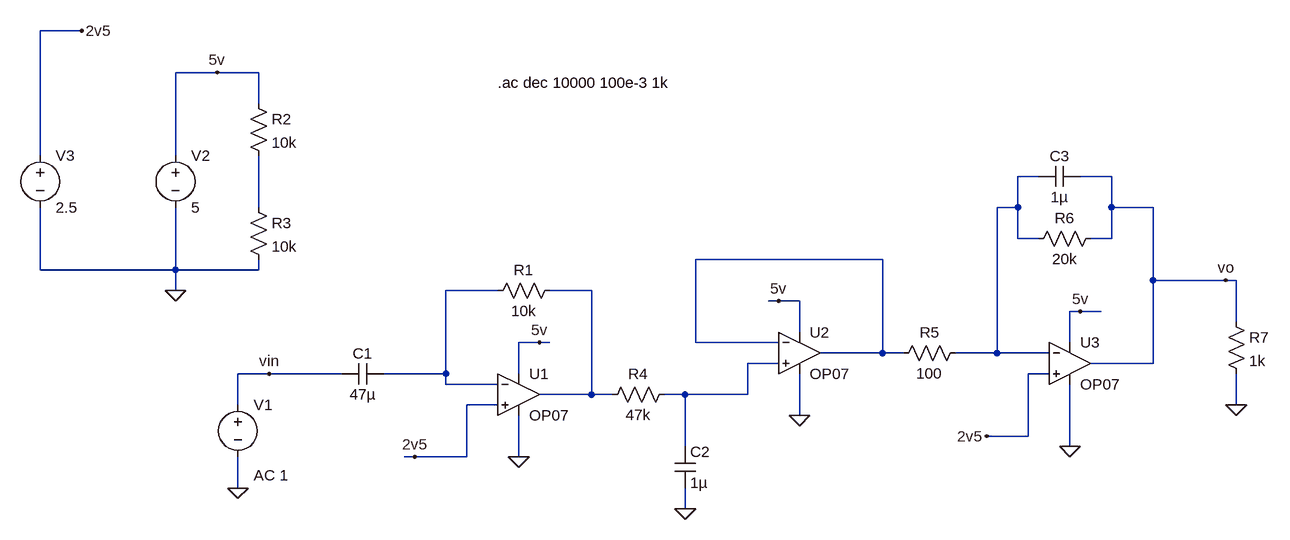
[diagram p0: schematic OpAmp3_AnDev.asc]
OpAmp3_AnDev.asc, the LTspice schematic file:
Version 4
SHEET 1 1240 680
WIRE -592 -400 -656 -400
WIRE -384 -336 -448 -336
WIRE -320 -336 -384 -336
WIRE -320 -288 -320 -336
WIRE -656 -208 -656 -400
WIRE -448 -208 -448 -336
WIRE 880 -176 848 -176
WIRE 992 -176 944 -176
WIRE -320 -128 -320 -208
WIRE 848 -128 848 -176
WIRE 848 -128 816 -128
WIRE 992 -128 992 -176
WIRE 1056 -128 992 -128
WIRE 848 -80 848 -128
WIRE 880 -80 848 -80
WIRE 992 -80 992 -128
WIRE 992 -80 960 -80
WIRE 640 -48 352 -48
WIRE -656 -32 -656 -128
WIRE -448 -32 -448 -128
WIRE -448 -32 -656 -32
WIRE -320 -32 -320 -48
WIRE -320 -32 -448 -32
WIRE 1056 -16 1056 -128
WIRE 1168 -16 1056 -16
WIRE 1184 -16 1168 -16
WIRE -448 0 -448 -32
WIRE 48 0 -32 0
WIRE 192 0 128 0
WIRE 480 16 464 16
WIRE 512 16 480 16
WIRE 944 32 928 32
WIRE 976 32 944 32
WIRE 1184 48 1184 -16
WIRE 512 64 512 16
WIRE 112 80 80 80
WIRE 128 80 112 80
WIRE 352 80 352 -48
WIRE 480 80 352 80
WIRE 928 80 928 32
WIRE 640 96 640 -48
WIRE 640 96 544 96
WIRE 672 96 640 96
WIRE 816 96 816 -128
WIRE 816 96 752 96
WIRE 896 96 816 96
WIRE 480 112 432 112
WIRE 1056 112 1056 -16
WIRE 1056 112 960 112
WIRE -304 128 -352 128
WIRE -192 128 -304 128
WIRE -32 128 -32 0
WIRE -32 128 -128 128
WIRE 80 128 80 80
WIRE 896 128 864 128
WIRE -32 144 -32 128
WIRE 48 144 -32 144
WIRE 192 160 192 0
WIRE 192 160 112 160
WIRE 224 160 192 160
WIRE 336 160 304 160
WIRE 432 160 432 112
WIRE 432 160 336 160
WIRE -352 176 -352 128
WIRE 48 176 0 176
WIRE 1184 176 1184 128
WIRE 512 192 512 128
WIRE 864 224 864 128
WIRE 864 224 800 224
WIRE 336 240 336 160
WIRE 928 240 928 144
WIRE -80 256 -96 256
WIRE 0 256 0 176
WIRE 0 256 -80 256
WIRE 80 256 80 192
WIRE -352 304 -352 256
WIRE 336 336 336 304
FLAG -352 304 0
FLAG -448 0 0
FLAG -384 -336 5v
FLAG 80 256 0
FLAG 112 80 5v
FLAG -80 256 2v5
FLAG 336 336 0
FLAG 512 192 0
FLAG 480 16 5v
FLAG 800 224 2v5
FLAG 928 240 0
FLAG 944 32 5v
FLAG 1184 176 0
FLAG -592 -400 2v5
FLAG 1168 -16 vo
FLAG -304 128 vin
SYMBOL OpAmps\\OP07 80 96 R0
SYMATTR InstName U1
SYMBOL OpAmps\\OP07 512 32 R0
SYMATTR InstName U2
SYMBOL OpAmps\\OP07 928 48 R0
SYMATTR InstName U3
SYMBOL cap -128 112 R90
WINDOW 0 0 32 VBottom 2
WINDOW 3 32 32 VTop 2
SYMATTR InstName C1
SYMATTR Value 47µ
SYMBOL voltage -352 160 R0
WINDOW 123 24 124 Left 2
WINDOW 39 0 0 Left 0
SYMATTR Value2 AC 1
SYMATTR InstName V1
SYMATTR Value ""
SYMBOL res 144 -16 R90
WINDOW 0 0 56 VBottom 2
WINDOW 3 32 56 VTop 2
SYMATTR InstName R1
SYMATTR Value 10k
SYMBOL voltage -448 -224 R0
SYMATTR InstName V2
SYMATTR Value 5
SYMBOL res -336 -304 R0
SYMATTR InstName R2
SYMATTR Value 10k
SYMBOL res -336 -144 R0
SYMATTR InstName R3
SYMATTR Value 10k
SYMBOL res 320 144 R90
WINDOW 0 0 56 VBottom 2
WINDOW 3 32 56 VTop 2
SYMATTR InstName R4
SYMATTR Value 47k
SYMBOL cap 320 240 R0
SYMATTR InstName C2
SYMATTR Value 1µ
SYMBOL res 768 80 R90
WINDOW 0 0 56 VBottom 2
WINDOW 3 32 56 VTop 2
SYMATTR InstName R5
SYMATTR Value 100
SYMBOL res 976 -96 R90
WINDOW 0 0 56 VBottom 2
WINDOW 3 32 56 VTop 2
SYMATTR InstName R6
SYMATTR Value 20k
SYMBOL cap 944 -192 R90
WINDOW 0 0 32 VBottom 2
WINDOW 3 32 32 VTop 2
SYMATTR InstName C3
SYMATTR Value 1µ
SYMBOL res 1168 32 R0
SYMATTR InstName R7
SYMATTR Value 1k
SYMBOL voltage -656 -224 R0
SYMATTR InstName V3
SYMATTR Value 2.5
TEXT 48 -320 Left 2 !.ac dec 10000 100e-3 1k

The netlist it stands for:
* OpAmp3_AnDev.asc
XU1 2v5 N004 5v 0 N005 LT1001  ; OP07, pins In+ In- V+ V- OUT
XU2 N006 N003 5v 0 N003 LT1001  ; OP07, pins In+ In- V+ V- OUT
XU3 2v5 N001 5v 0 vo LT1001  ; OP07, pins In+ In- V+ V- OUT
C1 N004 vin 47µ
V1 vin 0 AC 1
R1 N005 N004 10k
V2 5v 0 5
R2 5v N002 10k
R3 N002 0 10k
R4 N006 N005 47k
C2 N006 0 1µ
R5 N001 N003 100
R6 vo N001 20k
C3 vo N001 1µ
R7 vo 0 1k
V3 2v5 0 2.5
.ac dec 10000 100e-3 1k
.lib LTC.lib
.backanno
.end